# EAGLE schematic tank_motor_control (EAGLE 9.6.2)
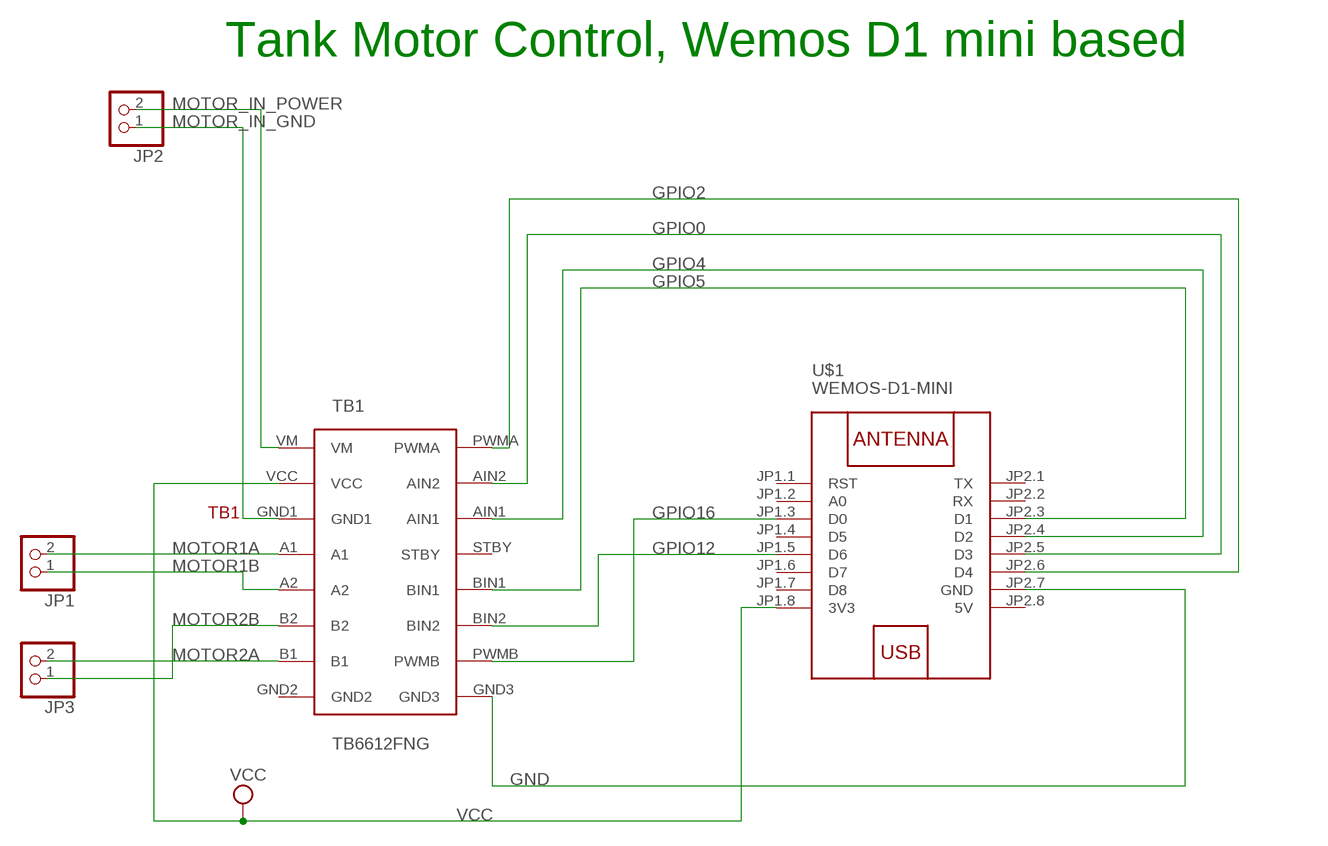
[diagram p0: schematic, sheet 1]

## Parts
JP1  PINHD-1X2/90  [1X02/90]
JP2  PINHD-1X2/90  [1X02/90]
JP3  PINHD-1X2/90  [1X02/90]
TB1  TB6612FNG  [TB6612FNG]
U$1  WEMOS-D1-MINI  [WEMOS-D1-MINI]

## Nets
GND: TB1.GND3 U$1.JP2.7(GND)
GPIO0: TB1.AIN2 U$1.JP2.5(D3)
GPIO2: TB1.PWMA U$1.JP2.6(D4)
GPIO4: TB1.AIN1 U$1.JP2.4(D2)
GPIO5: TB1.BIN1 U$1.JP2.3(D1)
GPIO12: TB1.BIN2 U$1.JP1.5(D6)
GPIO16: TB1.PWMB U$1.JP1.3(D0)
MOTOR1A: JP1.2 TB1.A1
MOTOR1B: JP1.1 TB1.A2
MOTOR2A: JP3.2 TB1.B1
MOTOR2B: JP3.1 TB1.B2
MOTOR_IN_GND: JP2.1 TB1.GND1
MOTOR_IN_POWER: JP2.2 TB1.VM
VCC: TB1.VCC U$1.JP1.8(3V3)
Unconnected: TB1.GND2 TB1.STBY U$1.JP1.1(RST) U$1.JP1.2(A0) U$1.JP1.4(D5) U$1.JP1.6(D7) U$1.JP1.7(D8) U$1.JP2.1(TX) U$1.JP2.2(RX)

## Notes on the sheet
- Tank Motor Control, Wemos D1 mini based

## Power pins joined to a net without a drawn wire
5V: U$1.JP2.8(5V)

## Library data of the parts
JP1-JP3 = pinhead:PINHD-1X2: PIN HEADER
TB1 = TB6612FNG:TB6612FNG
U$1 = diy-modules:WEMOS-D1-MINI: WEMOS D1 mini: Mini Wi-Fi Board based on ESP-8266 device More details can be found here: https://www.wemos.cc/product/d1-mini.html Click here to find device on ebay.com <http://www.ebay.com/sch/wemos+d1+mini+nodemcu>; OC_NEWARK: unknown